# EAGLE design me433_2019_motorboard (EAGLE 9.3.2)
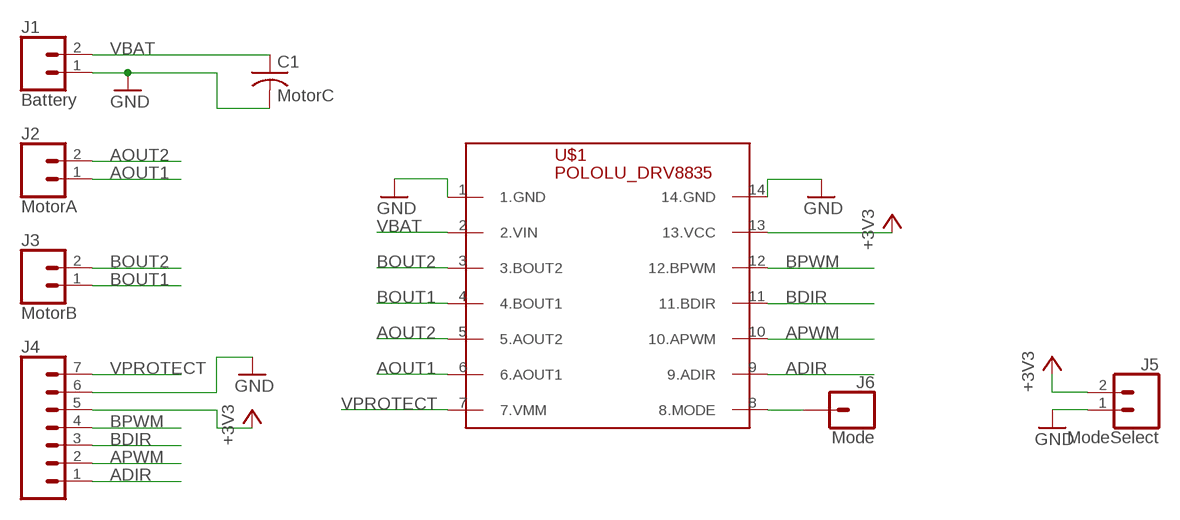
[diagram p0: schematic, sheet 1]

## Parts
C1  MotorC  C-US050-030X075  [C050-030X075]
J1  Battery  CONN_02  [1X02]
J2  MotorA  CONN_02  [1X02]
J3  MotorB  CONN_02  [1X02]
J4  CONN_07  [1X07]
J5  ModeSelect  CONN_02  [1X02]
J6  Mode  CONN_01  [1X01]
U$1  POLOLU_DRV8835  [DIL14]

## Nets
+3V3: J4.5 J5.2 U$1.13(13.VCC)
ADIR: J4.1 U$1.9(9.ADIR)
AOUT1: J2.1 U$1.6(6.AOUT1)
AOUT2: J2.2 U$1.5(5.AOUT2)
APWM: J4.2 U$1.10(10.APWM)
BDIR: J4.3 U$1.11(11.BDIR)
BOUT1: J3.1 U$1.4(4.BOUT1)
BOUT2: J3.2 U$1.3(3.BOUT2)
BPWM: J4.4 U$1.12(12.BPWM)
GND: C1.2 J1.1 J4.6 J5.1 U$1.1(1.GND) U$1.14(14.GND)
N$1: J6.1 U$1.8(8.MODE)
VBAT: C1.1 J1.2 U$1.2(2.VIN)
VPROTECT: J4.7 U$1.7(7.VMM)

## Library data of the parts
C1 = resistor:C-US: CAPACITOR, American symbol
J1-J3 J5 = me433_2019_motorboard:CONN_02: Multi connection point. Often used as Generic Header-pin footprint for 0.1 inch spaced/style header connections On any of the 0.1 inch spaced packages, you can populate with these: Break Away Headers - Straight <https://www.sparkfun.com/products/116> (PRT-00116) Break Away Male Headers - Right Angle <https://www.sparkfun.com/products/553> (PRT-00553) Female Headers <https://www.sparkfun.com/products/115> (PRT-00115) Break Away Headers - Machine Pin <https://www.sparkfun.com/products/117> (PRT-00117) Break Away Female Headers - Swiss Machine Pin <https://www.sparkfun.com/products/743> (PRT-00743) For SCREWTERMINALS and SPRING TERMINALS visit here: Screw Terimnals on SparkFun.com <https://www.sparkfun.com/search/results?term=Screw+Terminals> (5mm/3.5mm/2.54mm spacing) This device is also useful as a general connection point to wire up your design to another part of your project. Our various solder wires solder well into these plated through hole pads. Hook-Up Wire - Assortment (Stranded, 22 AWG) <https://www.sparkfun.com/products/11375> (PRT-11375) Hook-Up Wire - Assortment (Solid Core, 22 AWG) <https://www.sparkfun.com/products/11367> (PRT-11367) View the entire wire category on our website here <https://www.sparkfun.com/categories/141> Special notes: Molex polarized connector foot print use with: PRT-08233 with associated crimp pins and housings. 2.54_SCREWTERM for use with PRT-10571. 3.5mm Screw Terminal footprints for PRT-08084 5mm Screw Terminal footprints for use with PRT-08432
J4 = me433_2019_motorboard:CONN_07: Multi connection point. Often used as Generic Header-pin footprint for 0.1 inch spaced/style header connections On any of the 0.1 inch spaced packages, you can populate with these: Break Away Headers - Straight <https://www.sparkfun.com/products/116> (PRT-00116) Break Away Male Headers - Right Angle <https://www.sparkfun.com/products/553> (PRT-00553) Female Headers <https://www.sparkfun.com/products/115> (PRT-00115) Break Away Headers - Machine Pin <https://www.sparkfun.com/products/117> (PRT-00117) Break Away Female Headers - Swiss Machine Pin <https://www.sparkfun.com/products/743> (PRT-00743) For SCREWTERMINALS and SPRING TERMINALS visit here: Screw Terimnals on SparkFun.com <https://www.sparkfun.com/search/results?term=Screw+Terminals> (5mm/3.5mm/2.54mm spacing) This device is also useful as a general connection point to wire up your design to another part of your project. Our various solder wires solder well into these plated through hole pads. Hook-Up Wire - Assortment (Stranded, 22 AWG) <https://www.sparkfun.com/products/11375> (PRT-11375) Hook-Up Wire - Assortment (Solid Core, 22 AWG) <https://www.sparkfun.com/products/11367> (PRT-11367) View the entire wire category on our website here <https://www.sparkfun.com/categories/141> Special notes: Molex polarized connector foot print use with SKU : PRT-08231 with associated crimp pins and housings. 1MM SMD Version SKU: PRT-10208 NOTES ON THE VARIANTS LOCK and LOCK_LONGPADS... This footprint was designed to help hold the alignment of a through-hole component (i.e. 6-pin header) while soldering it into place. You may notice that each hole has been shifted either up or down by 0.005 of an inch from it's more standard position (which is a perfectly straight line). This slight alteration caused the pins (the squares in the middle) to touch the edges of the holes. Because they are alternating, it causes a "brace" to hold the component in place. 0.005 has proven to be the perfect amount of "off-center" position when using our standard breakaway headers. Although looks a little odd when you look at the bare footprint, once you have a header in there, the alteration is very hard to notice. Also,if you push a header all the way into place, it is covered up entirely on the bottom side.
J6 = me433_2019_motorboard:CONN_01: Single connection point. Often used as Generic Header-pin footprint for 0.1 inch spaced/style header connections On any of the 0.1 inch spaced packages, you can populate with these: Break Away Headers - Straight <https://www.sparkfun.com/products/116> (PRT-00116) Break Away Male Headers - Right Angle <https://www.sparkfun.com/products/553> (PRT-00553) Female Headers <https://www.sparkfun.com/products/115> (PRT-00115) Break Away Headers - Machine Pin <https://www.sparkfun.com/products/117> (PRT-00117) Break Away Female Headers - Swiss Machine Pin <https://www.sparkfun.com/products/743> (PRT-00743) This device is also useful as a general connection point to wire up your design to another part of your project. Our various solder wires solder well into these plated through hole pads. Hook-Up Wire - Assortment (Stranded, 22 AWG) <https://www.sparkfun.com/products/11375> (PRT-11375) Hook-Up Wire - Assortment (Solid Core, 22 AWG) <https://www.sparkfun.com/products/11367> (PRT-11367) View the entire wire category on our website here <https://www.sparkfun.com/categories/141> Special notes: SMTSO-256-ET is a "flush mount" nut for a 4-40 screw. We mostly use this on specialty testbeds; it is a nice way to connect hardware to your PCB at an adjustable hieght. Also note, the SNAP packages are for using a snappable style connector. We sell a baggie of snaps and they are also used on two LilyPad designs: Snap Assortment - 30 pack (male and female) <https://www.sparkfun.com/products/11347> (DEV-11347) LilyPad Arduino SimpleSnap <https://www.sparkfun.com/products/10941> (DEV-10941) LilyPad SimpleSnap Protoboard <https://www.sparkfun.com/products/10940> (DEV-10940)
U$1 = me433_2019_motorboard:POLOLU_DRV8835

## Board
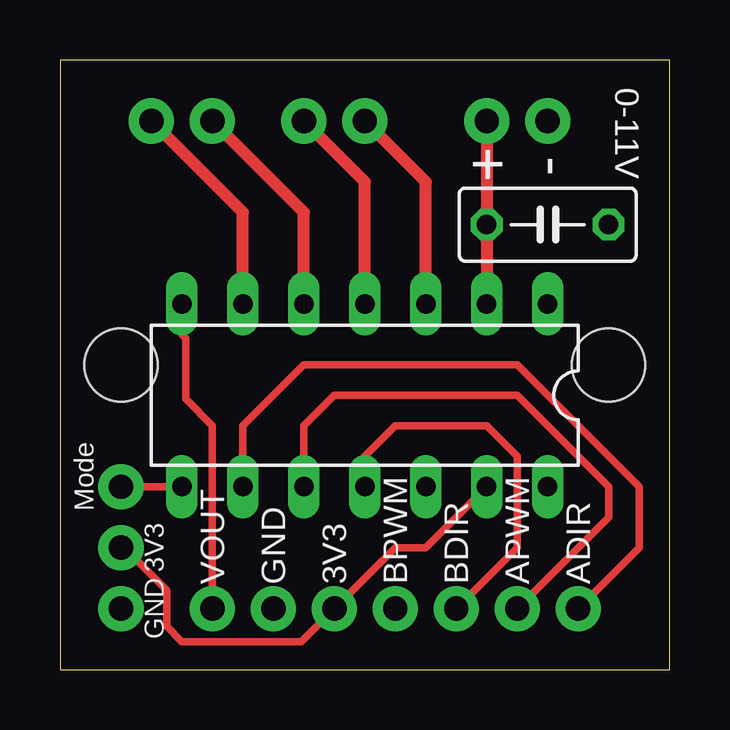
[diagram p1: board, top side]
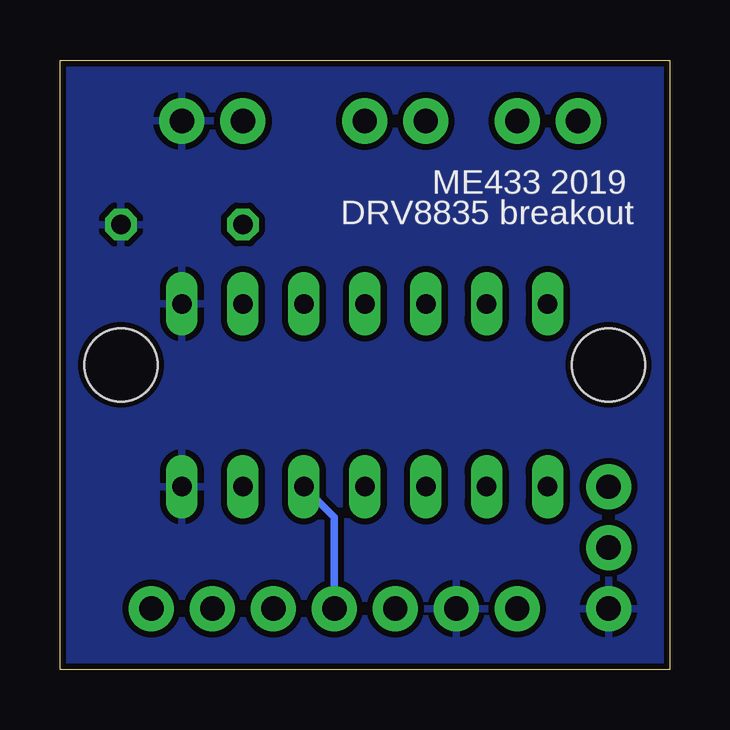
[diagram p2: board, bottom side, seen from below]

Size 25.4 x 25.4 mm. Coordinates in mm from the lower left corner, seen from the top.
Outline: 0,0 25.4,0 25.4,25.4 0,25.4 0,0
Copper layers (1*16): Top 0.035mm / dielectric 1.5mm / Bottom 0.035mm
Design rules "SeeedStudio_2layer_DRU_no_angle_20140221": minimum track width 6mil, minimum drill 12mil, track to track 6mil, track to pad 6mil, pad to pad 6mil, via to via 6mil, smd to smd 0mil, copper to edge 10mil, drill to drill 10mil, minimum pad ring 10mil, minimum via ring 6mil, stop-mask expansion 2mil, vias tented up to drill 100mil, thermal gap 10mil
Holes 3.05 mm at 2.54,12.7 22.86,12.7

### Footprints (pad centres in the part's own frame; a part is rotated, then mirrored left to right if it is on the bottom)
C050-030X075 = drill 0.813 octagon: 1 -2.54,0; 2 2.54,0
1X02 = drill 1.016 pad 1.88: 1 0,0; 2 2.54,0
1X07 = drill 1.016 pad 1.88: 1 0,0; 2 2.54,0; 3 5.08,0; 4 7.62,0; 5 10.16,0; 6 12.7,0; 7 15.24,0
1X01 = drill 1.016 pad 1.88: 1 0,0
DIL14 = drill 0.813 long: 1 -7.62,-3.81; 2 -5.08,-3.81; 3 -2.54,-3.81; 4 0,-3.81; 5 2.54,-3.81; 6 5.08,-3.81; 7 7.62,-3.81; 8 7.62,3.81; 9 5.08,3.81; 10 2.54,3.81; 11 0,3.81; 12 -2.54,3.81; 13 -5.08,3.81; 14 -7.62,3.81

### Placement (x,y rotation side)
C1  20.32,18.54 0 top
J1  20.32,22.86 180 top
J2  3.81,22.86 0 top
J3  10.16,22.86 0 top
J4  21.59,2.54 180 top
J5  2.54,2.54 90 top
J6  2.54,7.62 0 top
U$1  12.7,11.43 180 top

### Tracks (layer width: path | path; a pad name or v marks a point on that pad's centre or on a via)
+3V3
  Top 0.305: U$1.13 15.24,5.08 13.97,5.08 J4.5 10.06,1.17 5.08,1.17 4.45,1.8 4.45,3.3 2.67,5.08 J5.2
ADIR
  Top 0.305: U$1.9 7.62,10.16 10.16,12.7 19.05,12.7 24.13,7.62 24.13,5.08 J4.1
AOUT1
  Top 0.508: U$1.6 7.62,19.05 J2.1
AOUT2
  Top 0.508: U$1.5 10.16,19.05 J2.2
APWM
  Top 0.305: U$1.10 10.16,10.16 11.43,11.43 19.05,11.43 22.86,7.62 22.86,6.35 J4.2
BDIR
  Top 0.305: U$1.11 12.7,8.89 13.97,10.16 17.78,10.16 19.05,8.89 19.05,5.08 J4.3
BOUT1
  Top 0.508: U$1.4 12.7,20.32 J3.1
BOUT2
  Top 0.508: U$1.3 15.24,20.32 J3.2
BPWM
  Bottom 0.305: U$1.12 13.97,6.35 J4.4
GND
  pour Bottom (isolate 0.254): 0,0 0,25.4 25.4,25.4 25.4,0
N$1
  Top 0.305: U$1.8 J6.1
VBAT
  Top 0.508: J1.2 C1.1 U$1.2
VPROTECT
  Top 0.305: U$1.7 5.08,13.97 5.23,13.81 5.23,11.28 6.35,10.16 J4.7

### Text on the board
tPlace: 0-11V | - | + | Mode | 3V3 | VOUT | GND | 3V3 | BPWM | BDIR | APWM | ADIR | GND
bPlace: ME433 2019 | DRV8835 breakout